# EAGLE schematic good (EAGLE 9.6.2)
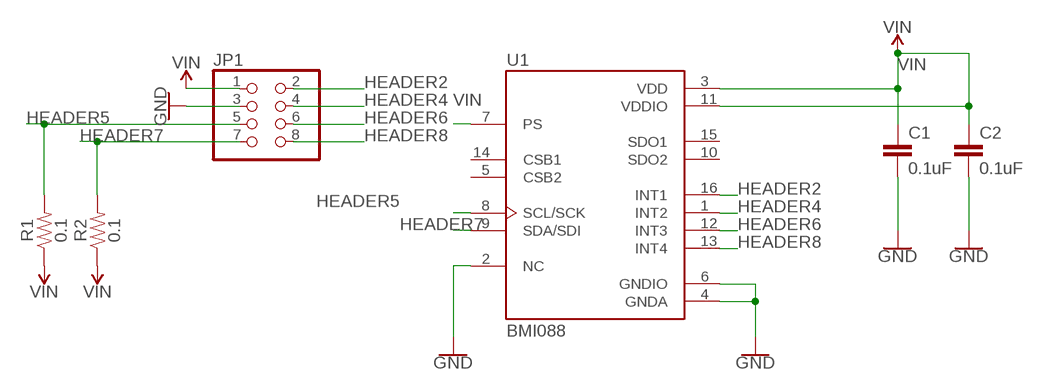
[diagram p0: schematic, sheet 1]

## Parts
C1  0.1uF  0.1UF-0402-16V-10%  [0402]
C2  0.1uF  0.1UF-0402-16V-10%  [0402]
JP1  PINHD-2X4  [2X04]
R1  0.1  0.1OHM-0603-1/3W-1%  [0603]
R2  0.1  0.1OHM-0603-1/3W-1%  [0603]
U1  BMI088  [PQFN50P450X300X100-16N]

## Nets
GND: C1.2 C2.2 JP1.3 U1.2(NC) U1.4(GNDA) U1.6(GNDIO)
HEADER2: JP1.2 U1.16(INT1)
HEADER4: JP1.4 U1.1(INT2)
HEADER5: JP1.5 R1.2 U1.8(SCL/SCK)
HEADER6: JP1.6 U1.12(INT3)
HEADER7: JP1.7 R2.2 U1.9(SDA/SDI)
HEADER8: JP1.8 U1.13(INT4)
VIN: C1.1 C2.1 JP1.1 R1.1 R2.1 U1.3(VDD) U1.7(PS) U1.11(VDDIO)
Unconnected: U1.5(CSB2) U1.10(SDO2) U1.14(CSB1) U1.15(SDO1)

## Library data of the parts
C1 C2 = SparkFun-Capacitors:0.1UF: 0.1µF ceramic capacitors A capacitor is a passive two-terminal electrical component used to store electrical energy temporarily in an electric field.; PROD_ID: CAP-12416
JP1 = adafruit:PINHD-2X4: PIN HEADER
R1 R2 = SparkFun-Resistors:0.1OHM: 0.1Ω resistor A resistor is a passive two-terminal electrical component that implements electrical resistance as a circuit element. Resistors act to reduce current flow, and, at the same time, act to lower voltage levels within circuits. - Wikipedia; PROD_ID: RES-15715
U1 = BMI088:BMI088: High-performance 6-axis inertial sensor (accelerometer + gyroscope) Check prices <https://pricing.snapeda.com/parts/BMI088/Bosch%20Sensortec/view-part?ref=eda> Check availability <https://pricing.snapeda.com/parts/BMI088/Bosch%20Sensortec/view-part?ref=eda>; AVAILABILITY: In Stock; DESCRIPTION: Accelerometer, Gyroscope, 6 Axis Sensor I²C, SPI Output; MF: Bosch Sensortec; MP: BMI088; PACKAGE: VFLGA-16 Bosch Sensortec; PRICE: None; PURCHASE-URL: https://pricing.snapeda.com/search/part/BMI088/?ref=eda